# Altium project WM210E_HW.PrjPcb
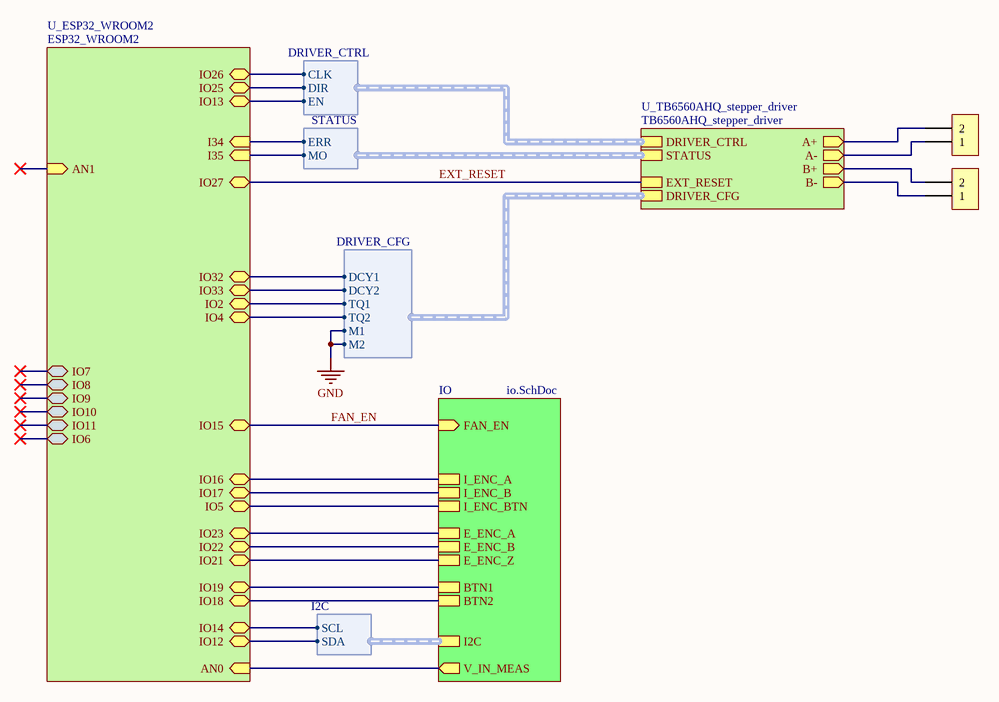
[diagram p0: top_sheet.SchDoc]
2 sheets, 31 parts. Net scope: hierarchical (ports join the sheet entries above them; power ports are global).
Board file: PCBv1.2.PcbDoc
Sheets:
  top_sheet.SchDoc
    IO = io.SchDoc

## Sheet top_sheet.SchDoc
size A4; SheetNumber: 1; SheetTotal: 4

### Parts
STP1  TBLOCK-M2  [TBLOCK-M2]  (value not drawn)
STP2  TBLOCK-M2  [TBLOCK-M2]  (value not drawn)

### Sub-sheets
IO = io.SchDoc: I_ENC_B, E_ENC_B, E_ENC_Z, I_ENC_BTN, I_ENC_A, I2C (harness I2C), BTN1, BTN2, E_ENC_A, V_IN_MEAS (out), FAN_EN (in)
U_ESP32_WROOM2 = ESP32_WROOM2 (file not in this document): IO25 (bidir), IO26 (bidir), IO27 (bidir), IO22 (bidir), IO23 (bidir), IO32 (bidir), IO19 (bidir), IO21 (bidir), IO33 (bidir), IO14 (bidir), IO12 (bidir), IO15 (bidir), IO16 (bidir), IO17 (bidir), IO18 (bidir), IO13 (bidir), I34 (in), I35 (in), IO5 (bidir), IO4 (bidir), IO2 (bidir), AN0 (in), AN1 (in), IO7 (bidir), IO8 (bidir), IO9 (bidir), IO10 (bidir), IO11 (bidir), IO6 (bidir)
U_TB6560AHQ_stepper_driver = TB6560AHQ_stepper_driver (file not in this document): DRIVER_CFG (harness DRIVER_CFG), DRIVER_CTRL (harness DRIVER_CTRL), STATUS (harness STATUS), A+ (out), A- (out), B+ (out), B- (out), EXT_RESET

### Harnesses
STATUS: ERR, MO
DRIVER_CTRL: CLK, DIR, EN
I2C: SCL, SDA
DRIVER_CFG: DCY1, DCY2, M1, M2, TQ1, TQ2

### Nets
GND: sheet U_TB6560AHQ_stepper_driver/DRIVER_CFG.M1, sheet U_TB6560AHQ_stepper_driver/DRIVER_CFG.M2
BTN1: sheet U_ESP32_WROOM2/IO19, sheet IO/BTN1
BTN2: sheet U_ESP32_WROOM2/IO18, sheet IO/BTN2
E_ENC_A: sheet U_ESP32_WROOM2/IO23, sheet IO/E_ENC_A
E_ENC_B: sheet U_ESP32_WROOM2/IO22, sheet IO/E_ENC_B
E_ENC_Z: sheet U_ESP32_WROOM2/IO21, sheet IO/E_ENC_Z
EXT_RESET: sheet U_TB6560AHQ_stepper_driver/EXT_RESET, sheet U_ESP32_WROOM2/IO27
FAN_EN: sheet U_ESP32_WROOM2/IO15, sheet IO/FAN_EN
I_ENC_A: sheet U_ESP32_WROOM2/IO16, sheet IO/I_ENC_A
I_ENC_B: sheet U_ESP32_WROOM2/IO17, sheet IO/I_ENC_B
I_ENC_BTN: sheet U_ESP32_WROOM2/IO5, sheet IO/I_ENC_BTN
SCL: sheet U_ESP32_WROOM2/IO14, sheet IO/I2C.SCL
SDA: sheet U_ESP32_WROOM2/IO12, sheet IO/I2C.SDA
V_IN_MEAS: sheet U_ESP32_WROOM2/AN0, sheet IO/V_IN_MEAS
NetSTP1_1: STP1.1 ; sheet U_TB6560AHQ_stepper_driver/A-
NetSTP1_2: STP1.2 ; sheet U_TB6560AHQ_stepper_driver/A+
NetSTP2_1: STP2.1 ; sheet U_TB6560AHQ_stepper_driver/B-
NetSTP2_2: STP2.2 ; sheet U_TB6560AHQ_stepper_driver/B+
(unnamed): sheet U_ESP32_WROOM2/IO25, sheet U_TB6560AHQ_stepper_driver/DRIVER_CTRL.DIR
(unnamed): sheet U_ESP32_WROOM2/IO26, sheet U_TB6560AHQ_stepper_driver/DRIVER_CTRL.CLK
(unnamed): sheet U_ESP32_WROOM2/IO32, sheet U_TB6560AHQ_stepper_driver/DRIVER_CFG.DCY1
(unnamed): sheet U_ESP32_WROOM2/IO33, sheet U_TB6560AHQ_stepper_driver/DRIVER_CFG.DCY2
(unnamed): sheet U_ESP32_WROOM2/IO13, sheet U_TB6560AHQ_stepper_driver/DRIVER_CTRL.EN
(unnamed): sheet U_ESP32_WROOM2/I34, sheet U_TB6560AHQ_stepper_driver/STATUS.ERR
(unnamed): sheet U_ESP32_WROOM2/I35, sheet U_TB6560AHQ_stepper_driver/STATUS.MO
(unnamed): sheet U_ESP32_WROOM2/IO4, sheet U_TB6560AHQ_stepper_driver/DRIVER_CFG.TQ2
(unnamed): sheet U_ESP32_WROOM2/IO2, sheet U_TB6560AHQ_stepper_driver/DRIVER_CFG.TQ1

## Sheet io.SchDoc
size A4; SheetNumber: 2; SheetTotal: 4
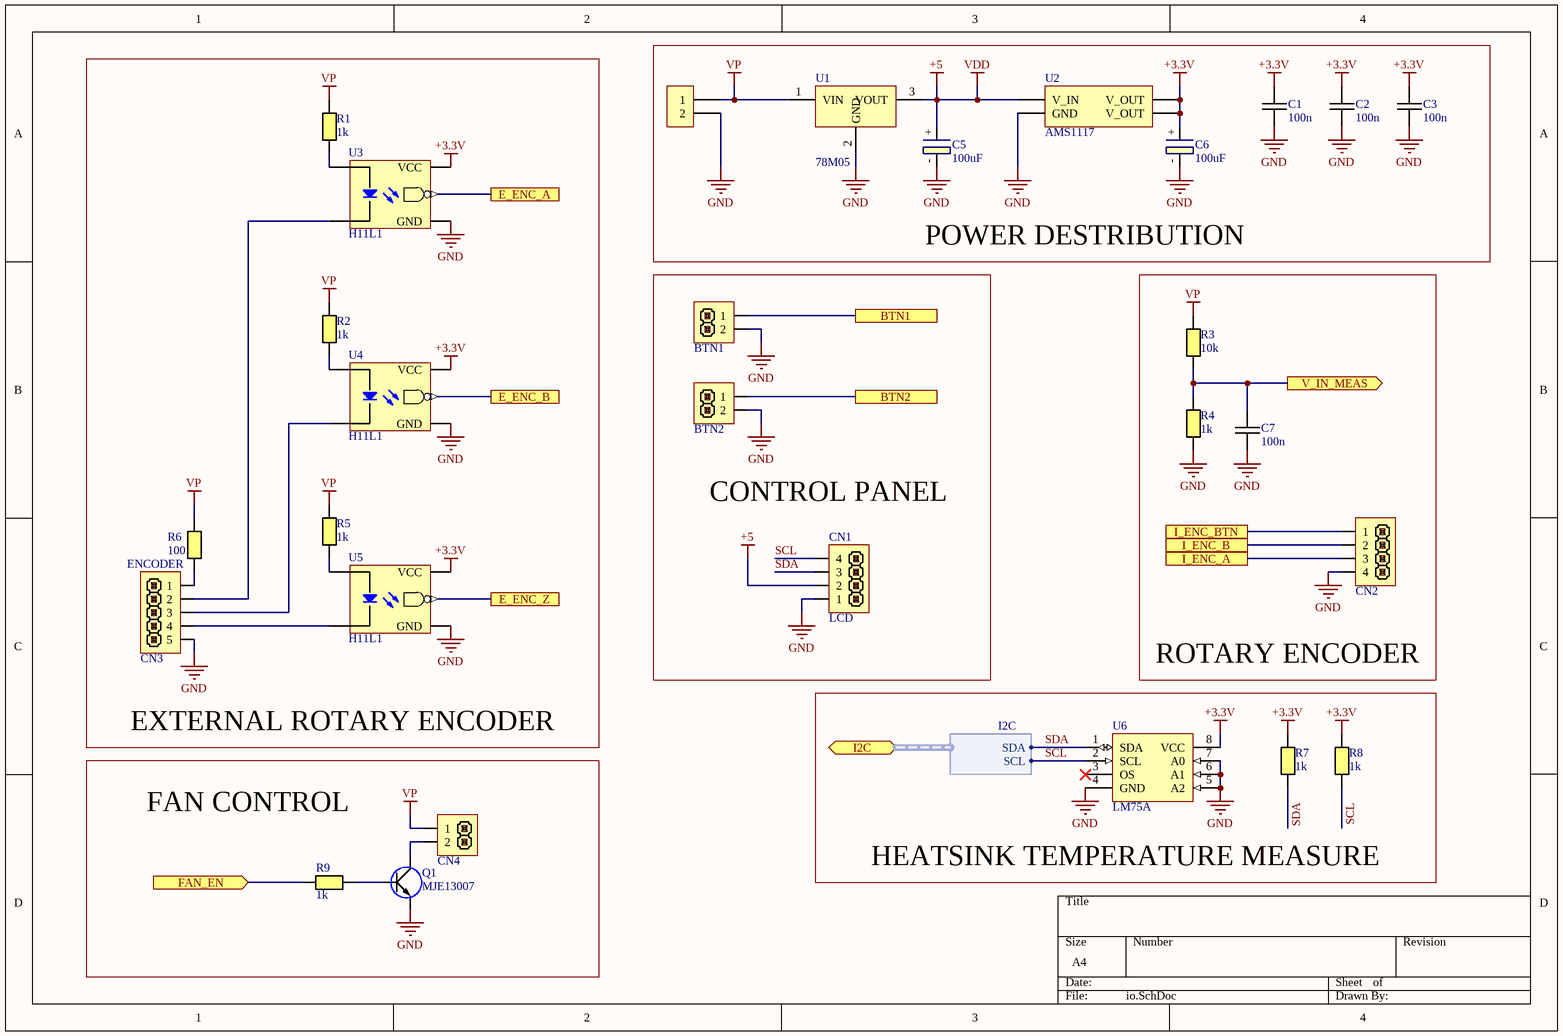
[diagram p1: io.SchDoc]

### Parts
BTN1  PIN HEADER 1x2  [XH2.54 2P]  (value not drawn)
BTN2  PIN HEADER 1x2  [XH2.54 2P]  (value not drawn)
C1  100n  [CAPC0603(1608)55_N]
C2  100n  [CAPC0603(1608)55_N]
C3  100n  [CAPC0603(1608)55_N]
C5  100uF  [TC7343]
C6  100uF  [TC7343]
C7  100n  [CAPC0603(1608)55_N]
CN1  LCD  [XH2.54 4P]
CN2  PIN HEADER 1x4  [XH2.54 4P]  (value not drawn)
CN3  ENCODER  [XH2.54 5P]
CN4  PIN HEADER 1x2  [XH2.54 2P]  (value not drawn)
PWR1  TBLOCK-M2  [TBLOCK-M2]  (value not drawn)
Q1  MJE13007  [TO-220-3 H]
R1  1k  [RESC0603(1608)_N]
R2  1k  [RESC0603(1608)_N]
R3  10k  [RESC0603(1608)_N]
R4  1k  [RESC0603(1608)_N]
R5  1k  [RESC0603(1608)_N]
R6  100  [RESC0603(1608)_N]
R7  1k  [RESC0603(1608)_N]
R8  1k  [RESC0603(1608)_N]
R9  1k  [RESC0603(1608)_N]
U1  78M05  [TO-252]
U2  AMS1117  [SOT229P700X180-4N]
U3  H11L1  [DIP06]
U4  H11L1  [DIP06]
U5  H11L1  [DIP06]
U6  LM75A  [SO8]

### Blocks framed on the sheet
EXTERNAL ROTARY ENCODER: CN3 R1 R2 R5 R6 U3-U5
POWER DESTRIBUTION: C1-C3 C5 C6 PWR1 U1 U2
CONTROL PANEL: BTN1 BTN2 CN1
ROTARY ENCODER: C7 CN2 R3 R4
HEATSINK TEMPERATURE MEASURE: R7 R8 U6
FAN CONTROL: CN4 Q1 R9

### Ports
BTN1, BTN2, E_ENC_A, E_ENC_B, E_ENC_Z, FAN_EN (in), I2C (bidir, harness I2C), I_ENC_A, I_ENC_B, I_ENC_BTN, V_IN_MEAS (out)

### Harnesses
I2C: SDA, SCL

### Nets
+3.3V: C1.1 C2.1 C3.1 C6.+ R7.2 R8.2 U2.2(V_OUT) U2.4(V_OUT) U3.6(VCC) U4.6(VCC) U5.6(VCC) U6.8(VCC)
+5: C5.+ CN1.2 U1.3(VOUT) U2.3(V_IN)  [also labelled VDD]
GND: BTN1.2 BTN2.2 C1.2 C2.2 C3.2 C5.- C6.- C7.2 CN1.1 CN2.4 CN3.5 PWR1.2 Q1.3(E) R4.1 U1.2(GND) U2.1(GND) U3.5(GND) U4.5(GND) U5.5(GND) U6.4(GND) U6.5(A2) U6.6(A1) U6.7(A0)
VP: CN4.1 PWR1.1 R1.2 R2.2 R3.2 R5.2 R6.2 U1.1(VIN)
BTN1: BTN1.1 ; port BTN1
BTN2: BTN2.1 ; port BTN2
E_ENC_A: U3.4(Vo) ; port E_ENC_A
E_ENC_B: U4.4(Vo) ; port E_ENC_B
E_ENC_Z: U5.4(Vo) ; port E_ENC_Z
FAN_EN: R9.1 ; port FAN_EN
I_ENC_A: CN2.3 ; port I_ENC_A
I_ENC_B: CN2.2 ; port I_ENC_B
I_ENC_BTN: CN2.1 ; port I_ENC_BTN
SCL: CN1.4 R8.1 U6.2(SCL) ; port I2C.SCL
SDA: CN1.3 R7.1 U6.1(SDA) ; port I2C.SDA
V_IN_MEAS: C7.1 R3.1 R4.2 ; port V_IN_MEAS
NetCN3_1: CN3.1 R6.1
NetCN3_2: CN3.2 U3.2(C)
NetCN3_3: CN3.3 U4.2(C)
NetCN3_4: CN3.4 U5.2(C)
NetCN4_2: CN4.2 Q1.2(C)
NetQ1_1: Q1.1(B) R9.2
NetR1_1: R1.1 U3.1(A)
NetR2_1: R2.1 U4.1(A)
NetR5_1: R5.1 U5.1(A)

Not connected (* = marked no-connect by the designer): U6 3(OS)*

### Library data of the parts
BTN1 BTN2 CN4 = PIN HEADER 2.54 1x2
C1-C3 C7 = Capacitor M: Ceramic capacitor Medium density; Value: 100n
C5 C6 = Capacitor Electrolitic: Value: 100uF
CN1 CN2 = PIN HEADER 2.54 1x4
CN3 = PIN HEADER 2.54 1x5
Q1 = MJE13007: Switch-mode NPN Bipolar  Power Transistor; Vceo: 400V; Vces: 700V; Vebo: 9V; Ic: 8A; hfe: 30-40; Fmax: 14MHz
R1-R9 = Resistor M: Resistor Medium Density
  R1 R2 R4 R5 R7-R9: Value: 1k
  R3: Value: 10k
  R6: Value: 100
U1 = 78M05: Linear Voltage Regulator; DC Input Voltage MAX: 30V; Output Current: 300..700mA
U2 = AMS1117: 800mA LDO  15V max
U3-U5 = H11L1: If max: 30mA; Vf (10mA): 1.2V; If ON/OFF: 1mA
U6 = LM75A: Digital temperature sensor